# Altium schematic sheet HA_Diagram.SchDoc
size A4; PageSetup: Record=PageOptions|CenterHorizontal=True|CenterVertical=True|PrintScale=1.00|XCorrection=1.00|YCorrection=1.00|PrintKind=0|BorderSize=5000000|LeftOffset=0|BottomOffset=0|Orientation=2|PaperLength=1000|PaperWidth=1000|Scale=100|PaperSource=7|PrintQuality=-3|MediaType=1|DitherType=10|PrintScaleMode=1|PaperKind=A4|PaperIndex=9
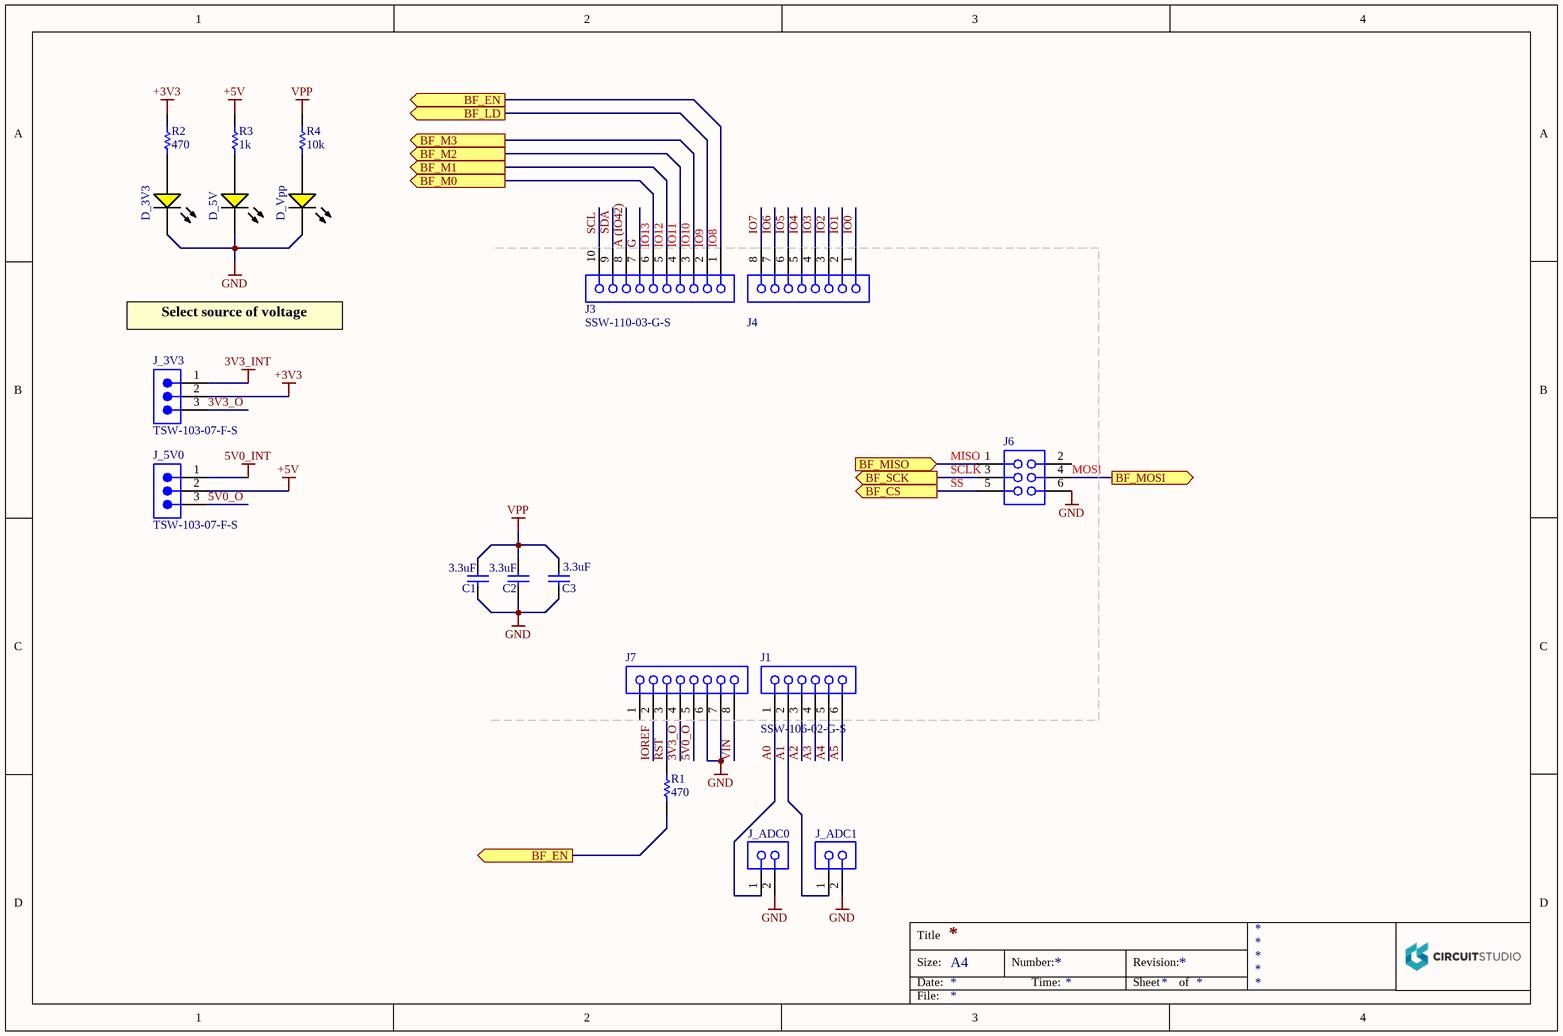
[diagram p0: HA_Diagram.SchDoc]

## Parts
C1  value 3.3uF  [CAPC1206(3216)190_N]  (hidden comment: 3.3uF 100V)
C2  value 3.3uF  [CAPC1206(3216)190_N]  (hidden comment: 3.3uF 100V)
C3  value 3.3uF  [CAPC1206(3216)190_N]  (hidden comment: 3.3uF 100V)
D_3V3  LED 0603  [LTST-C190KSKT_V]  (value not drawn)
D_5V  LED 0603  [LTST-C190KSKT_V]  (value not drawn)
D_Vpp  LED 0603  [LTST-C190KSKT_V]  (value not drawn)
J1  SSW-106-02-G-S  [SMTC-SSW-106-02-X-S]
J3  SSW-110-03-G-S  [SMTC-SSW-110-03-X-S]
J4  SSQ-108-01-F-S  [SMTC-SSQ-108-01-X-S]  (value not drawn)
J6  SSW-103-01-F-D  [SMTC-SSW-103-01-X-D]  (value not drawn)
J7  SSQ-108-01-F-S  [SMTC-SSQ-108-01-X-S]  (value not drawn)
J_3V3  TSW-103-07-F-S  [SMTC-TSW-103-07-X-S]
J_5V0  TSW-103-07-F-S  [SMTC-TSW-103-07-X-S]
J_ADC0  PHF-102-03-L-S  [SMTC-PHF-102-03-X-S]  (value not drawn)
J_ADC1  PHF-102-03-L-S  [SMTC-PHF-102-03-X-S]  (value not drawn)
R1  470  [RESC0603(1608)_N]
R2  470  [RESC0603(1608)_N]
R3  1k  [RESC0603(1608)_N]
R4  10k  [RESC0603(1608)_N]

## Ports
BF_CS (out), BF_EN (out), BF_LD (out), BF_M0 (out), BF_M1 (out), BF_M2 (out), BF_M3 (out), BF_MISO (in), BF_MOSI (out), BF_SCK (out)

## Nets
3V3_INT: J_3V3.1
5V0_INT: J_5V0.1
+3V3: J_3V3.2 R2.1
+5V: J_5V0.2 R3.1
GND: C1.1 C2.1 C3.1 D_3V3.2(K) D_5V.2(K) D_Vpp.2(K) J6.6 J7.6 J7.7 J_ADC0.2 J_ADC1.2
VPP: C1.2 C2.2 C3.2 R4.1
3V3_O: J7.4 J_3V3.3
5V0_O: J7.5 J_5V0.3
A0: J1.1 J_ADC0.1
A1: J1.2 J_ADC1.1
A2: J1.3
A3: J1.4
A4: J1.5
A5: J1.6
A (IO42): J3.8
BF_CS: J6.5 ; port BF_CS
BF_EN: J3.1 R1.2 ; port BF_EN
BF_LD: J3.2 ; port BF_LD
BF_M0: J3.6 ; port BF_M0
BF_M1: J3.5 ; port BF_M1
BF_M2: J3.4 ; port BF_M2
BF_M3: J3.3 ; port BF_M3
BF_MISO: J6.1 ; port BF_MISO
BF_MOSI: J6.4 ; port BF_MOSI
BF_SCK: J6.3 ; port BF_SCK
G: J3.7
IO0: J4.1
IO1: J4.2
IO2: J4.3
IO3: J4.4
IO4: J4.5
IO5: J4.6
IO6: J4.7
IO7: J4.8
IOREF: J7.2
RST: J7.3 R1.1
SCL: J3.10
SDA: J3.9
VIN: J7.8
NetD_3V3_1: D_3V3.1(A) R2.2
NetD_5V_1: D_5V.1(A) R3.2
NetD_Vpp_1: D_Vpp.1(A) R4.2

Not connected (* = marked no-connect by the designer): J6 2; J7 1

## Notes on the sheet
- (near J3) IO13
- (near J3) IO12
- (near J3) IO11
- (near J3) IO10
- (near J3) IO9
- (near J3) IO8
- Select source of voltage
- (near J6) MISO
- (near J6) SCLK
- (near J6) SS
- (near J6) MOSI
- Title
- Size:
- Date:
- A4
- Number:
- Time:
- Revision:
- Sheet
- of
- File:

## Library data of the parts
C1-C3 = CMP-1037-04411-1: CAP 3.3uF 100V ±20% 1206 (3216 Metric) Thickness 1.9mm SMD; Case-Metric: 3216; Tolerance: Â±20%; Case-EIA: 1206; Max Thickness: 1.9 mm; Rated Voltage: 100 V; Technology: SMT
D_3V3 D_5V D_Vpp = CMP-1674-00009-1: Voltage Rating: 50 V; Case\Package: 0603; Power Rating: 100 mW; Tolerance: 1%; Resistance: 12 kohm; Packaging: Tape and Reel; RoHSCompliant: true; Height: 0.45 mm; Max Operating Temperature: 155 degC; Mount: Surface Mount; DatasheetVersion: Rev. I, 10/2012; Min Operating Temperature: -55 degC; PackageReference: C190KSKT; ComponentLink1Description: Manufacturer URL; Length: 1.6 mm; REACH SVHC: No SVHC; Case Code (Imperial): 0603; Voltage Rating (DC): 50 V; PackageDescription: 2-Pin Surface Mount Device, Body 1.6 x 0.8 mm; Case Code (Metric): 1608; Package Quantity: 5000; ComponentLink2Description: Datasheet; Width: 0.8 mm; Pins: 2; ComponentLink2URL: http://optoelectronics.liteon.com/upload/download/DS-22-99-0189/S_110_LTST-C190KSKT.pdf; ComponentLink1URL: http://www.us.liteon.com/
J1 = CMP-1023-00359-1: SQ Post Socket, Through-hole, Vertical, -55 to 125 degC, 2.54mm Pitch, 6-Pin, Female, RoHS; Manufacturer: Samtec; ComponentLink1Description: Manufacturer URL; Pitch: 2.54 mm; ComponentLink1URL: http://www.samtec.com; ComponentLink2Description: Datasheet; PackageVersion: CA, 6/1987; Orientation: Vertical; RoHS: True; PackageReference: SSW-106-02-X-S; ComponentLink2URL: http://www.samtec.com/documents/webfiles/pdf/SSW_TH.PDF; Mounting Technology: Through-hole; Temperature Range: -55 to 125 degC; PackageDescription: Assembly, Socket Strip .016 X .031 Tail; DatasheetVersion: F-214; ComponentLink3Description: Package Specification; PartNumber: SSW-106-02-G-S; ComponentLink3URL: http://www.samtec.com/documents/webfiles/cpdf/SSW-1XX-XX-XXX-X-XX-XXX-XX-MKT.pdf
J3 = CMP-1023-00394-1: SQ Post Socket, Through-hole, Vertical, -55 to 125 degC, 2.54 mm Pitch, 10-Pin, Female, RoHS; Manufacturer: Samtec; Pitch: 2.54 mm; PartNumber: SSW-110-03-G-S; ComponentLink2Description: Datasheet; ComponentLink3URL: http://www.samtec.com/documents/webfiles/cpdf/SSW-1XX-XX-XXX-X-XX-XXX-XX-MKT.pdf; ComponentLink1URL: http://www.samtec.com; RoHS: True; ComponentLink1Description: Manufacturer URL; ComponentLink2URL: http://www.samtec.com/documents/webfiles/pdf/SSW_TH.PDF; Temperature Range: -55 to 125 degC; PackageDescription: Assembly, Socket Strip .016 X .031 Tail; ComponentLink3Description: Package Specification; PackageReference: SSW-110-03-X-S; Orientation: Vertical; DatasheetVersion: F-214; PackageVersion: CA, 6/1987; Mounting Technology: Through-hole
J4 J7 = CMP-1023-00294-1: SQ Post Socket, Through-hole, Vertical, -55 to 125 degC, 2.54 mm Pitch, 8-Pin, Female, RoHS; Manufacturer: Samtec; Pitch: 2.54 mm; ComponentLink3URL: http://www.samtec.com/documents/webfiles/cpdf/SSQ-1XX-XX-XXX-X-XX-XXX-XX-X-MKT.pdf; ComponentLink2URL: http://www.samtec.com/documents/webfiles/pdf/SSQ_TH.PDF; Mounting Technology: Through-hole; PackageReference: SSQ-108-01-X-S; Orientation: Vertical; PackageDescription: Assembly, Socket Strip .025[0.64] SQ Tail; ComponentLink2Description: Datasheet; PartNumber: SSQ-108-01-F-S; Temperature Range: -55 to 125 degC; ComponentLink1URL: http://www.samtec.com; ComponentLink3Description: Package Specification; PackageVersion: BD, 6/1987; RoHS: True; ComponentLink1Description: Manufacturer URL; DatasheetVersion: F-214
J6 = CMP-1023-00329-1: SQ Post Socket, Through-hole, Vertical, -55 to 125 degC, 2.54 mm Pitch, 6-Pin, Female, RoHS; Manufacturer: Samtec; Pitch: 2.54 mm; Temperature Range: -55 to 125 degC; ComponentLink3URL: http://www.samtec.com/documents/webfiles/cpdf/SSW-1XX-XX-XXX-X-XX-XXX-XX-MKT.pdf; ComponentLink1URL: http://www.samtec.com; Orientation: Vertical; PackageReference: SSW-103-01-X-D; RoHS: True; ComponentLink1Description: Manufacturer URL; PartNumber: SSW-103-01-F-D; PackageVersion: CA, 6/1987; ComponentLink2URL: http://www.samtec.com/documents/webfiles/pdf/SSW_TH.PDF; ComponentLink3Description: Package Specification; Mounting Technology: Through-hole; PackageDescription: Assembly, Socket Strip .016 X .031 Tail; DatasheetVersion: F-214; ComponentLink2Description: Datasheet
J_3V3 J_5V0 = CMP-1024-00331-1: 0.025" SQ Post Header, Through-hole, Vertical, -55 to 125 degC, 2.54 mm Pitch, 3-Pin, Male, RoHS; Manufacturer: Samtec; Pitch: 2.54 mm; DatasheetVersion: F-214; ComponentLink1Description: Manufacturer URL; ComponentLink3URL: http://www.samtec.com/documents/webfiles/cpdf/TSW-XXX-XX-XXX-X-XX-XXX-MKT.pdf; Mounting Technology: Through-hole; PackageDescription: .025[0.64] SQ. Post Terminal Strip Assembly; Temperature Range: -55 to 125 degC; ComponentLink3Description: Package Specification; Orientation: Vertical; PartNumber: TSW-103-07-F-S; RoHS: True; PackageVersion: DM, 8/1988; ComponentLink2Description: Datasheet; ComponentLink1URL: http://www.samtec.com; ComponentLink2URL: http://www.samtec.com/documents/webfiles/pdf/TSW_TH.PDF; PackageReference: TSW-103-07-X-S
J_ADC0 J_ADC1 = CMP-1023-00105-1: Press Fit Socket, Through-hole, Vertical, -55 to 125 degC, 2.54 mm Pitch, 2-Pin, Female, RoHS; Manufacturer: Samtec; Pitch: 2.54 mm; Orientation: Vertical; RoHS: True; DatasheetVersion: F-214; PackageReference: PHF-102-03-X-S; Temperature Range: -55 to 125 degC; ComponentLink1Description: Manufacturer URL; ComponentLink3Description: Package Specification; PackageVersion: F, 9/2009; ComponentLink2Description: Datasheet; ComponentLink3URL: http://www.samtec.com/documents/webfiles/cpdf/PHF-1XX-XX-X-X-XXX-MKT.pdf; PartNumber: PHF-102-03-L-S; ComponentLink1URL: http://www.samtec.com; ComponentLink2URL: http://www.samtec.com/documents/webfiles/pdf/phf.pdf; Mounting Technology: Through-hole; PackageDescription: .100 Press Fit Socket Assembly
R1-R4 = CMP-1012-00122-1: 200 1% 0603 SMD; Value: 200 Ohm; Tolerance: 1 %